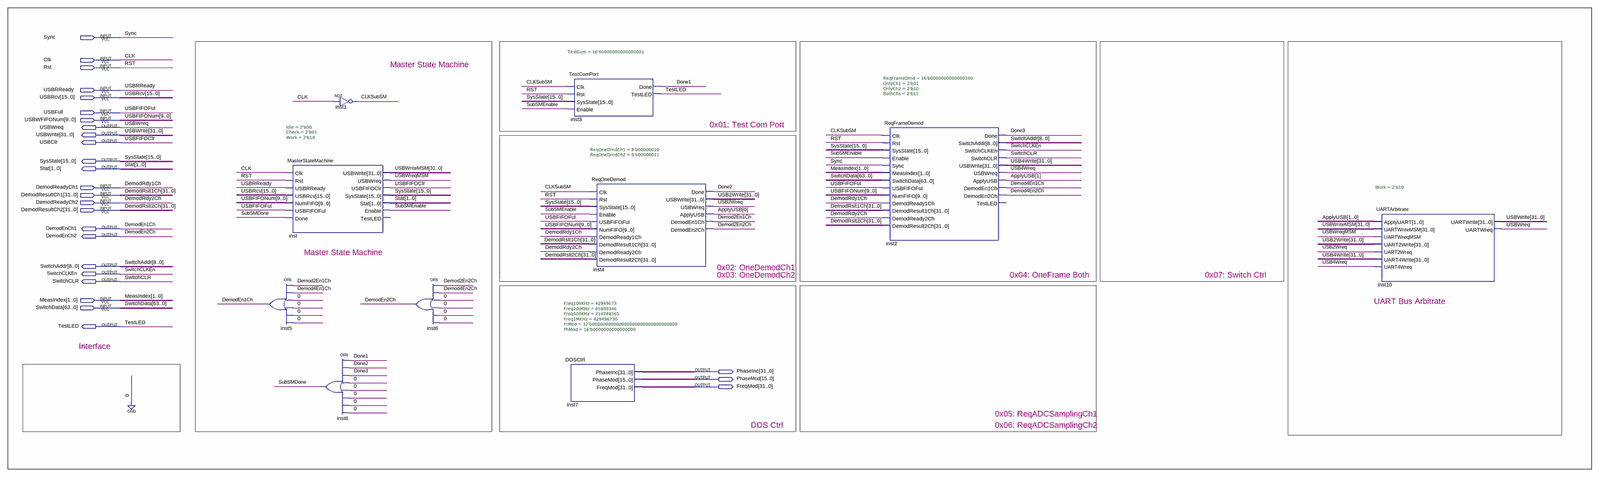
[diagram p0: schematic sheet, whole]
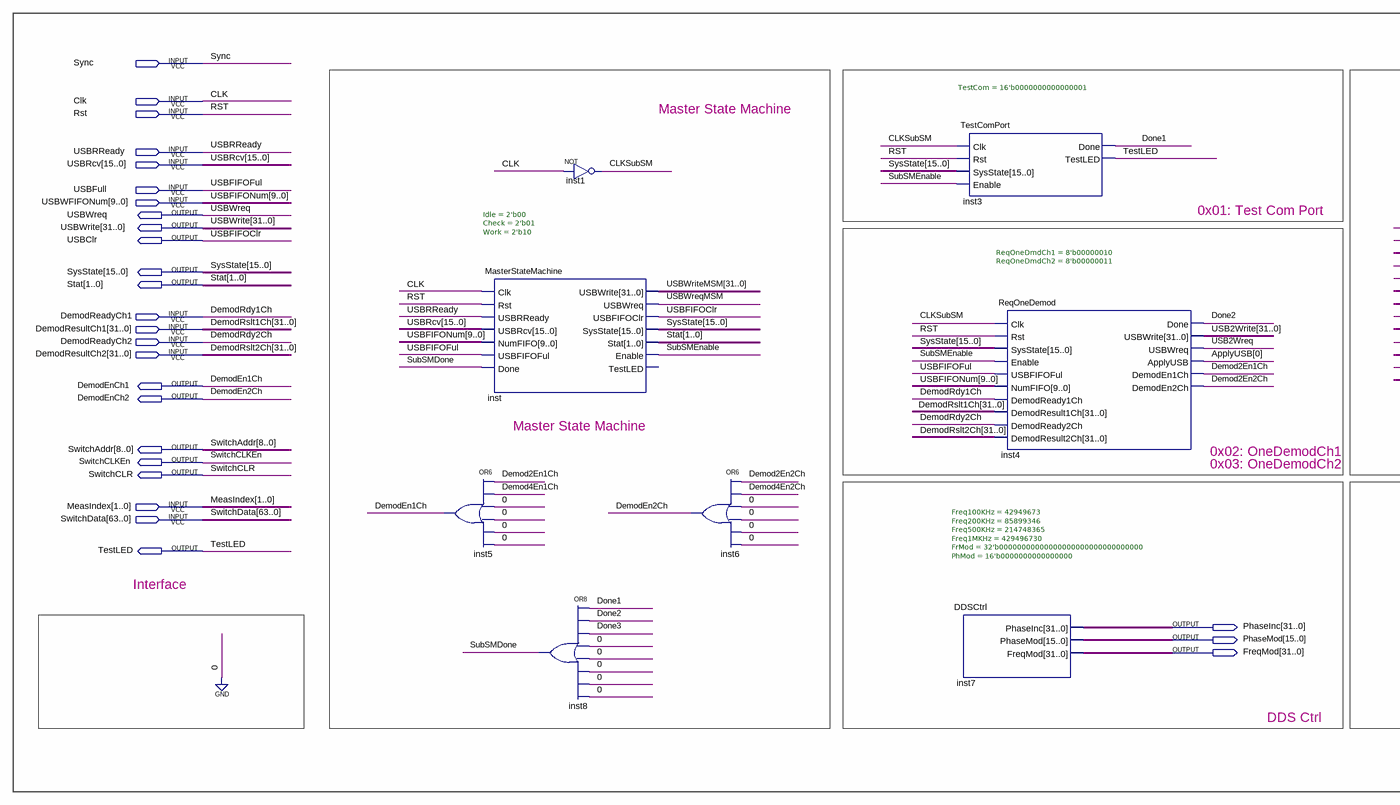
[diagram p1: schematic sheet, left part]
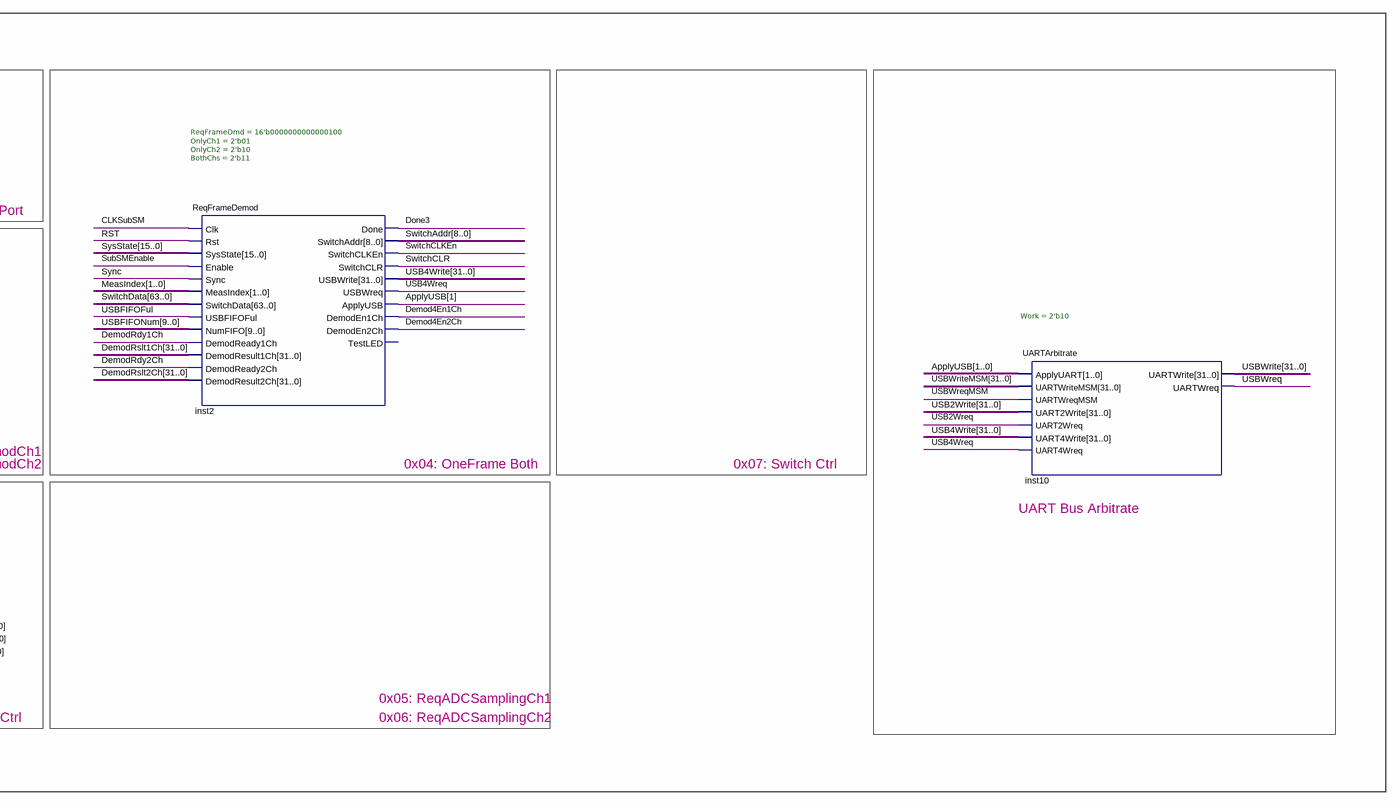
[diagram p2: schematic sheet, right part]
// Quartus schematic ControlCenter.bdf as structural Verilog: 10 symbols, 27 pins
module ControlCenter (
  input  Sync,
  input  Clk,
  input  Rst,
  input  USBRReady,
  input  [15:0] USBRcv,
  input  USBFull,
  input  [9:0] USBWFIFONum,
  input  DemodReadyCh1,
  input  [31:0] DemodResultCh1,
  input  DemodReadyCh2,
  input  [31:0] DemodResultCh2,
  input  [1:0] MeasIndex,
  input  [63:0] SwitchData,
  output USBWreq,
  output [31:0] USBWrite,
  output USBClr,
  output [15:0] SysState,
  output [1:0] Stat,
  output DemodEnCh1,
  output DemodEnCh2,
  output [8:0] SwitchAddr,
  output SwitchCLKEn,
  output SwitchCLR,
  output TestLED,
  output [31:0] PhaseInc,
  output [15:0] PhaseMod,
  output [31:0] FreqMod
);

  wire CLKSubSM, Demod2En1Ch, Demod2En2Ch, Demod4En1Ch, Demod4En2Ch, Done1, Done2, Done3, SubSMDone,
       SubSMEnable, USB2Wreq, USB4Wreq, USBWreqMSM;
  wire [1:0] ApplyUSB;
  wire [31:0] USB2Write, USB4Write, USBWriteMSM;

  or inst5 (DemodEnCh1, Demod2En1Ch, Demod4En1Ch, 1'b0, 1'b0, 1'b0, 1'b0);
  MasterStateMachine #(.Idle(2'b00), .Check(2'b01), .Work(2'b10)) inst (
    .Clk(Clk), .Rst(Rst), .USBRReady(USBRReady), .USBRcv(USBRcv), .NumFIFO(USBWFIFONum),
    .USBFIFOFul(USBFull), .Done(SubSMDone), .USBWrite(USBWriteMSM), .USBWreq(USBWreqMSM),
    .USBFIFOClr(USBClr), .SysState(SysState), .Stat(Stat), .Enable(SubSMEnable));  // open: TestLED
  not inst1 (CLKSubSM, Clk);
  or inst8 (SubSMDone, Done1, Done2, Done3, 1'b0, 1'b0, 1'b0, 1'b0, 1'b0);
  or inst6 (DemodEnCh2, Demod2En2Ch, Demod4En2Ch, 1'b0, 1'b0, 1'b0, 1'b0);
  TestComPort #(.TestCom(16'b0000000000000001)) inst3 (
    .Clk(CLKSubSM), .Rst(Rst), .SysState(SysState), .Enable(SubSMEnable), .Done(Done1), .TestLED(TestLED));
  DDSCtrl #(.Freq100KHz(42949673), .Freq200KHz(85899346), .Freq500KHz(214748365), .Freq1MKHz(429496730), .FrMod(32'b00000000000000000000000000000000), .PhMod(16'b0000000000000000)) inst7 (
    .PhaseInc(PhaseInc), .PhaseMod(PhaseMod), .FreqMod(FreqMod));
  ReqOneDemod #(.ReqOneDmdCh1(8'b00000010), .ReqOneDmdCh2(8'b00000011)) inst4 (
    .Clk(CLKSubSM), .Rst(Rst), .SysState(SysState), .Enable(SubSMEnable), .USBFIFOFul(USBFull),
    .NumFIFO(USBWFIFONum), .DemodReady1Ch(DemodReadyCh1), .DemodResult1Ch(DemodResultCh1),
    .DemodReady2Ch(DemodReadyCh2), .DemodResult2Ch(DemodResultCh2), .Done(Done2), .USBWrite(USB2Write),
    .USBWreq(USB2Wreq), .ApplyUSB(ApplyUSB[0]), .DemodEn1Ch(Demod2En1Ch), .DemodEn2Ch(Demod2En2Ch));
  ReqFrameDemod #(.ReqFrameDmd(16'b0000000000000100), .OnlyCh1(2'b01), .OnlyCh2(2'b10), .BothChs(2'b11)) inst2 (
    .Clk(CLKSubSM), .Rst(Rst), .SysState(SysState), .Enable(SubSMEnable), .Sync(Sync), .MeasIndex(MeasIndex),
    .SwitchData(SwitchData), .USBFIFOFul(USBFull), .NumFIFO(USBWFIFONum), .DemodReady1Ch(DemodReadyCh1),
    .DemodResult1Ch(DemodResultCh1), .DemodReady2Ch(DemodReadyCh2), .DemodResult2Ch(DemodResultCh2),
    .Done(Done3), .SwitchAddr(SwitchAddr), .SwitchCLKEn(SwitchCLKEn), .SwitchCLR(SwitchCLR),
    .USBWrite(USB4Write), .USBWreq(USB4Wreq), .ApplyUSB(ApplyUSB[1]), .DemodEn1Ch(Demod4En1Ch),
    .DemodEn2Ch(Demod4En2Ch));  // open: TestLED
  UARTArbitrate #(.Work(2'b10)) inst10 (
    .ApplyUART(ApplyUSB), .UARTWriteMSM(USBWriteMSM), .UARTWreqMSM(USBWreqMSM), .UART2Write(USB2Write),
    .UART2Wreq(USB2Wreq), .UART4Write(USB4Write), .UART4Wreq(USB4Wreq), .UARTWrite(USBWrite),
    .UARTWreq(USBWreq));

  // Other names for the same wires on the sheet: DemodEn1Ch = DemodEnCh1; DemodEn2Ch = DemodEnCh2;
  //   DemodRdy1Ch = DemodReadyCh1; DemodRdy2Ch = DemodReadyCh2; DemodRslt1Ch[31:0] = DemodResultCh1;
  //   DemodRslt2Ch[31:0] = DemodResultCh2; USBFIFOClr = USBClr; USBFIFOFul = USBFull; USBFIFONum[9:0] = USBWFIFONum

  // Notes on the sheet:
  //   Master State Machine
  //   0x01: Test Com Port
  //   Master State Machine
  //   0x02: OneDemodCh1
  //   0x03: OneDemodCh2
  //   0x04: OneFrame Both
  //   0x07: Switch Ctrl
  //   UART Bus Arbitrate
  //   Interface
  //   0x05: ReqADCSamplingCh1
  //   DDS Ctrl
  //   0x06: ReqADCSamplingCh2
endmodule
